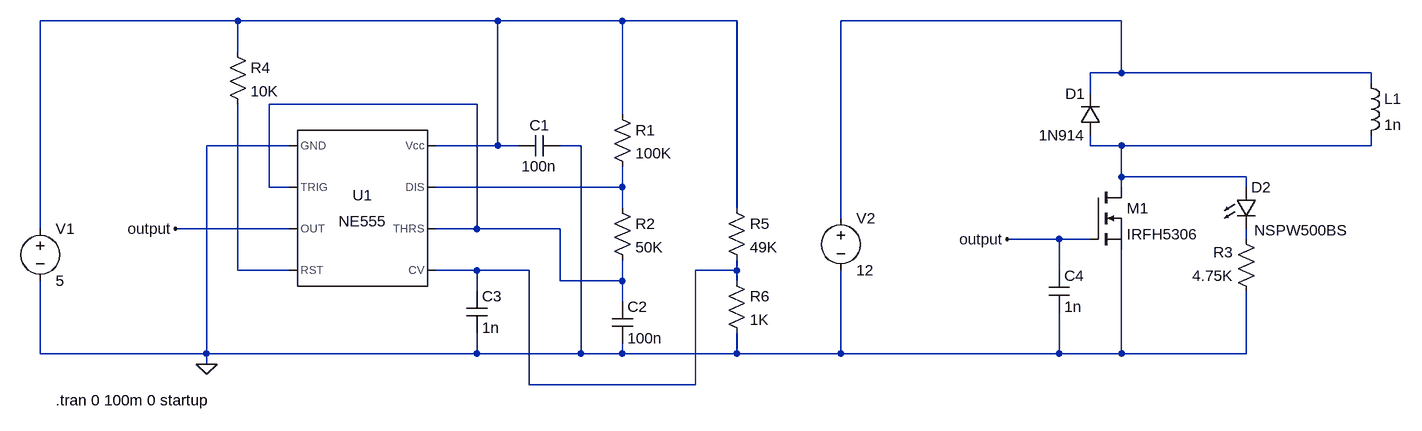
[diagram p0: schematic oscillatorWithTimer555.asc]
oscillatorWithTimer555.asc, the LTspice schematic file:
Version 4
SHEET 1 1252 680
WIRE -1904 32 -2208 32
WIRE -1504 32 -1904 32
WIRE -1312 32 -1504 32
WIRE -1136 32 -1312 32
WIRE -544 32 -976 32
WIRE -1904 80 -1904 32
WIRE -544 112 -544 32
WIRE -544 112 -592 112
WIRE -160 112 -544 112
WIRE -160 128 -160 112
WIRE -592 144 -592 112
WIRE -1536 160 -1856 160
WIRE -1312 176 -1312 32
WIRE -1824 224 -1952 224
WIRE -1504 224 -1504 32
WIRE -1504 224 -1600 224
WIRE -1472 224 -1504 224
WIRE -1376 224 -1408 224
WIRE -592 224 -592 208
WIRE -544 224 -592 224
WIRE -160 224 -160 208
WIRE -160 224 -544 224
WIRE -544 272 -544 224
WIRE -352 272 -544 272
WIRE -1856 288 -1856 160
WIRE -1824 288 -1856 288
WIRE -1312 288 -1312 256
WIRE -1312 288 -1600 288
WIRE -544 288 -544 272
WIRE -352 288 -352 272
WIRE -1312 320 -1312 288
WIRE -1136 320 -1136 32
WIRE -976 336 -976 32
WIRE -2208 352 -2208 32
WIRE -1824 352 -2000 352
WIRE -1536 352 -1536 160
WIRE -1536 352 -1600 352
WIRE -1408 352 -1536 352
WIRE -640 368 -720 368
WIRE -592 368 -640 368
WIRE -352 368 -352 352
WIRE -1904 416 -1904 160
WIRE -1824 416 -1904 416
WIRE -1536 416 -1600 416
WIRE -1456 416 -1536 416
WIRE -1136 416 -1136 400
WIRE -1136 416 -1200 416
WIRE -640 416 -640 368
WIRE -1408 432 -1408 352
WIRE -1312 432 -1312 400
WIRE -1312 432 -1408 432
WIRE -1136 432 -1136 416
WIRE -1536 448 -1536 416
WIRE -1312 464 -1312 432
WIRE -2208 544 -2208 432
WIRE -1952 544 -1952 224
WIRE -1952 544 -2208 544
WIRE -1536 544 -1536 512
WIRE -1536 544 -1952 544
WIRE -1376 544 -1376 224
WIRE -1376 544 -1536 544
WIRE -1312 544 -1312 528
WIRE -1312 544 -1376 544
WIRE -1136 544 -1136 512
WIRE -1136 544 -1312 544
WIRE -976 544 -976 416
WIRE -976 544 -1136 544
WIRE -640 544 -640 480
WIRE -640 544 -976 544
WIRE -544 544 -544 384
WIRE -544 544 -640 544
WIRE -352 544 -352 448
WIRE -352 544 -544 544
WIRE -1952 560 -1952 544
WIRE -1456 592 -1456 416
WIRE -1200 592 -1200 416
WIRE -1200 592 -1456 592
FLAG -2000 352 output
FLAG -1952 560 0
FLAG -720 368 output
SYMBOL Misc\\NE555 -1712 320 R0
SYMATTR InstName U1
SYMBOL voltage -2208 336 R0
WINDOW 123 0 0 Left 2
WINDOW 39 0 0 Left 2
SYMATTR InstName V1
SYMATTR Value 5
SYMBOL cap -1472 240 R270
WINDOW 0 32 32 VTop 2
WINDOW 3 0 32 VBottom 2
SYMATTR InstName C1
SYMATTR Value 100n
SYMBOL res -1328 160 R0
SYMATTR InstName R1
SYMATTR Value 100K
SYMBOL res -1328 304 R0
SYMATTR InstName R2
SYMATTR Value 50K
SYMBOL res -1920 64 R0
SYMATTR InstName R4
SYMATTR Value 10K
SYMBOL cap -1328 464 R0
SYMATTR InstName C2
SYMATTR Value 100n
SYMBOL cap -1552 448 R0
SYMATTR InstName C3
SYMATTR Value 1n
SYMBOL nmos -592 288 R0
SYMATTR InstName M1
SYMATTR Value IRFH5306
SYMBOL voltage -976 320 R0
WINDOW 123 0 0 Left 2
WINDOW 39 0 0 Left 2
SYMATTR InstName V2
SYMATTR Value 12
SYMBOL ind -176 112 R0
SYMATTR InstName L1
SYMATTR Value 1n
SYMBOL diode -576 208 R180
WINDOW 0 24 64 Left 2
WINDOW 3 24 0 Left 2
SYMATTR InstName D1
SYMATTR Value 1N914
SYMBOL LED -368 288 R0
WINDOW 3 28 66 Left 2
SYMATTR InstName D2
SYMATTR Value NSPW500BS
SYMBOL res -336 464 R180
WINDOW 0 36 76 Left 2
WINDOW 3 36 40 Left 2
SYMATTR InstName R3
SYMATTR Value 4.75K
SYMATTR SpiceLine tol=1 pwr=0.1
SYMBOL cap -656 416 R0
SYMATTR InstName C4
SYMATTR Value 1n
SYMBOL res -1152 304 R0
SYMATTR InstName R5
SYMATTR Value 49K
SYMBOL res -1152 416 R0
SYMATTR InstName R6
SYMATTR Value 1K
TEXT -2184 616 Left 2 !.tran 0 100m 0 startup

The netlist it stands for:
* oscillatorWithTimer555.asc
XU1 0 N003 output N007 N008 N003 N005 N001 NE555  ; pins GND TRIG OUT RST CV THRS DIS Vcc
V1 N001 0 5
C1 N001 0 100n
R1 N001 N005 100K
R2 N005 N003 50K
R4 N001 N007 10K
C2 N003 0 100n
C3 N008 0 1n
M1 N004 output 0 0 IRFH5306
V2 N002 0 12
L1 N002 N004 1n
D1 N004 N002 1N914
D2 N004 N006 NSPW500BS
R3 0 N006 4.75K tol=1 pwr=0.1
C4 output 0 1n
R5 N001 N008 49K
R6 N008 0 1K
.model D D
.lib standard.dio
.model NMOS NMOS
.model PMOS PMOS
.lib standard.mos
.tran 0 100m 0 startup
.lib NE555.sub
.backanno
.end